# EAGLE design HUD-mohterboard (EAGLE 7.5.0)
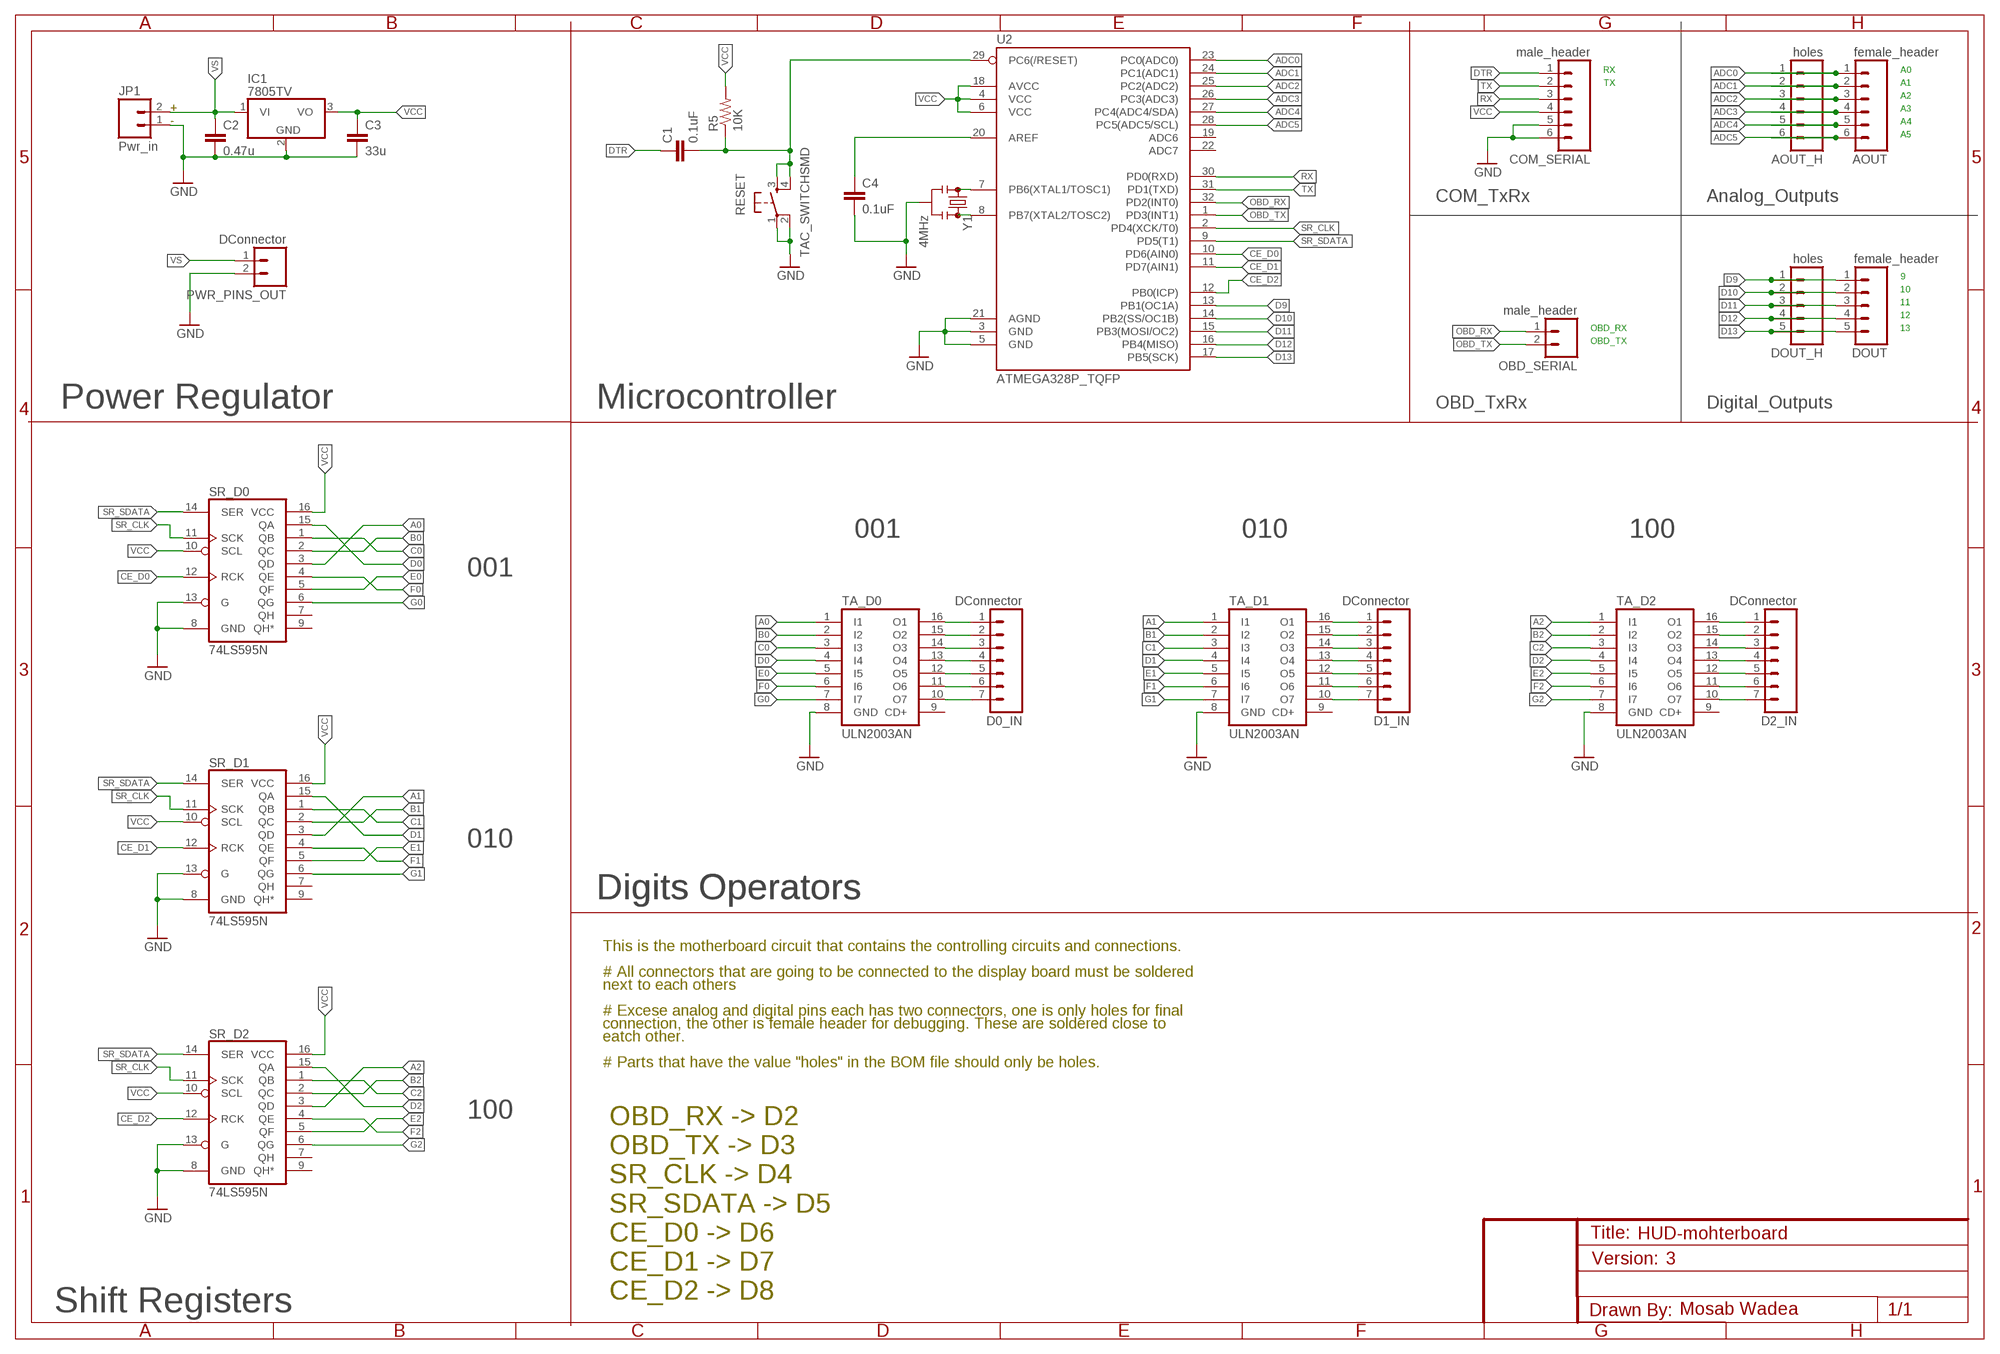
[diagram p0: schematic, sheet 1]

## Parts
AOUT  female_header  M06SILK_FEMALE_PTH  [1X06]
AOUT_H  holes  M06SILK_FEMALE_PTH  [1X06]
C1  0.1uF  CAP0805  [0805]
C2  0.47u  CAP0805  [0805]
C3  33u  CAP0805  [0805]
C4  0.1uF  CAP0805  [0805]
COM_SERIAL  male_header  M06SILK_FEMALE_PTH  [1X06]
D0_IN  DConnector  M07  [1X07]
D1_IN  DConnector  M07  [1X07]
D2_IN  DConnector  M07  [1X07]
DOUT  female_header  M05PTH  [1X05]
DOUT_H  holes  M05PTH  [1X05]
IC1  7805TV  [TO220V]
JP1  Pwr_in  M02PTH  [1X02]
OBD_SERIAL  male_header  M02PTH  [1X02]
PWR_PINS_OUT  DConnector  M02PTH  [1X02]
R5  10K  RESISTOR0805-RES  [0805]
RESET  TAC_SWITCHSMD  [TACTILE-SWITCH-SMD]
SR_D0  74LS595N  [DIL16]
SR_D1  74LS595N  [DIL16]
SR_D2  74LS595N  [DIL16]
TA_D0  ULN2003AN  [DIL16]
TA_D1  ULN2003AN  [DIL16]
TA_D2  ULN2003AN  [DIL16]
U2  ATMEGA328P_TQFP  [TQFP32-08]
Y1  4MHz  RESONATOR4MHZ  [RESONATOR-SMD_MED]

## Nets
A0: SR_D0.3(QD) TA_D0.1(I1)
A1: SR_D1.3(QD) TA_D1.1(I1)
A2: SR_D2.3(QD) TA_D2.1(I1)
ADC0: AOUT.1 AOUT_H.1 U2.23(PC0(ADC0))
ADC1: AOUT.2 AOUT_H.2 U2.24(PC1(ADC1))
ADC2: AOUT.3 AOUT_H.3 U2.25(PC2(ADC2))
ADC3: AOUT.4 AOUT_H.4 U2.26(PC3(ADC3))
ADC4: AOUT.5 AOUT_H.5 U2.27(PC4(ADC4/SDA))
ADC5: AOUT.6 AOUT_H.6 U2.28(PC5(ADC5/SCL))
B0: SR_D0.2(QC) TA_D0.2(I2)
B1: SR_D1.2(QC) TA_D1.2(I2)
B2: SR_D2.2(QC) TA_D2.2(I2)
C0: SR_D0.1(QB) TA_D0.3(I3)
C1: SR_D1.1(QB) TA_D1.3(I3)
C2: SR_D2.1(QB) TA_D2.3(I3)
CE_D0: SR_D0.12(RCK) U2.10(PD6(AIN0))
CE_D1: SR_D1.12(RCK) U2.11(PD7(AIN1))
CE_D2: SR_D2.12(RCK) U2.12(PB0(ICP))
D0: SR_D0.15(QA) TA_D0.4(I4)
D1: SR_D1.15(QA) TA_D1.4(I4)
D2: SR_D2.15(QA) TA_D2.4(I4)
D9: DOUT.1 DOUT_H.1 U2.13(PB1(OC1A))
D10: DOUT.2 DOUT_H.2 U2.14(PB2(SS/OC1B))
D11: DOUT.3 DOUT_H.3 U2.15(PB3(MOSI/OC2))
D12: DOUT.4 DOUT_H.4 U2.16(PB4(MISO))
D13: DOUT.5 DOUT_H.5 U2.17(PB5(SCK))
DTR: C1.1 COM_SERIAL.1
E0: SR_D0.5(QF) TA_D0.5(I5)
E1: SR_D1.5(QF) TA_D1.5(I5)
E2: SR_D2.5(QF) TA_D2.5(I5)
F0: SR_D0.4(QE) TA_D0.6(I6)
F1: SR_D1.4(QE) TA_D1.6(I6)
F2: SR_D2.4(QE) TA_D2.6(I6)
G0: SR_D0.6(QG) TA_D0.7(I7)
G1: SR_D1.6(QG) TA_D1.7(I7)
G2: SR_D2.6(QG) TA_D2.7(I7)
GND: C2.2 C3.2 C4.2 COM_SERIAL.5 COM_SERIAL.6 IC1.2(GND) JP1.1 PWR_PINS_OUT.2 RESET.1 RESET.2 SR_D0.8(GND) SR_D0.13(G) SR_D1.8(GND) SR_D1.13(G) SR_D2.8(GND) SR_D2.13(G) TA_D0.8(GND) TA_D1.8(GND) TA_D2.8(GND) U2.3(GND) U2.5(GND) U2.21(AGND) Y1.2
N$1: U2.7(PB6(XTAL1/TOSC1)) Y1.1
N$2: U2.8(PB7(XTAL2/TOSC2)) Y1.3
N$3: D0_IN.2 TA_D0.15(O2)
N$4: D0_IN.3 TA_D0.14(O3)
N$5: D0_IN.4 TA_D0.13(O4)
N$6: D0_IN.5 TA_D0.12(O5)
N$7: D0_IN.6 TA_D0.11(O6)
N$8: D1_IN.3 TA_D1.14(O3)
N$9: D1_IN.4 TA_D1.13(O4)
N$10: D1_IN.5 TA_D1.12(O5)
N$11: D2_IN.4 TA_D2.13(O4)
N$12: C4.1 U2.20(AREF)
N$29: D1_IN.2 TA_D1.15(O2)
N$30: D1_IN.1 TA_D1.16(O1)
N$32: D1_IN.6 TA_D1.11(O6)
N$33: D1_IN.7 TA_D1.10(O7)
N$43: D0_IN.1 TA_D0.16(O1)
N$46: D0_IN.7 TA_D0.10(O7)
N$55: D2_IN.3 TA_D2.14(O3)
N$56: D2_IN.2 TA_D2.15(O2)
N$57: D2_IN.1 TA_D2.16(O1)
N$58: D2_IN.5 TA_D2.12(O5)
N$59: D2_IN.6 TA_D2.11(O6)
N$60: D2_IN.7 TA_D2.10(O7)
OBD_RX: OBD_SERIAL.1 U2.32(PD2(INT0))
OBD_TX: OBD_SERIAL.2 U2.1(PD3(INT1))
RESET_WIRE: C1.2 R5.1 RESET.3 RESET.4 U2.29(PC6(/RESET))
RX: COM_SERIAL.3 U2.30(PD0(RXD))
SR_CLK: SR_D0.11(SCK) SR_D1.11(SCK) SR_D2.11(SCK) U2.2(PD4(XCK/T0))
SR_SDATA: SR_D0.14(SER) SR_D1.14(SER) SR_D2.14(SER) U2.9(PD5(T1))
TX: COM_SERIAL.2 U2.31(PD1(TXD))
VCC: C3.1 COM_SERIAL.4 IC1.3(VO) R5.2 SR_D0.10(SCL) SR_D0.16(VCC) SR_D1.10(SCL) SR_D1.16(VCC) SR_D2.10(SCL) SR_D2.16(VCC) U2.4(VCC) U2.6(VCC) U2.18(AVCC)
VS: C2.1 IC1.1(VI) JP1.2 PWR_PINS_OUT.1
Unconnected: SR_D0.7(QH) SR_D0.9(QH*) SR_D1.7(QH) SR_D1.9(QH*) SR_D2.7(QH) SR_D2.9(QH*) TA_D0.9(CD+) TA_D1.9(CD+) TA_D2.9(CD+) U2.19(ADC6) U2.22(ADC7)

## Notes on the sheet
- RX | A0
- TX | A1
- A2
- + | A3
- - | A4
- A5
- COM_TxRx | Analog_Outputs
- 9
- 10
- 11
- 12
- OBD_RX | 13
- OBD_TX
- Power Regulator | Microcontroller | OBD_TxRx | Digital_Outputs
- 001 | 010 | 100
- 001
- 010
- Digits Operators | Digits Operators
- This is the motherboard circuit that contains the controlling circuits and connections.
- # All connectors that are going to be connected to the display board must be soldered
- next to each others
- # Excese analog and digital pins each has two connectors, one is only holes for final
- connection, the other is female header for debugging. These are soldered close to
- eatch other.
- # Parts that have the value "holes" in the BOM file should only be holes.
- 100
- 3
- OBD_RX -> D2
  OBD_TX -> D3
  SR_CLK -> D4
  SR_SDATA -> D5
  CE_D0 -> D6
  CE_D1 -> D7
  CE_D2 -> D8
- Shift Registers | Mosab Wadea

## Library data of the parts
AOUT AOUT_H COM_SERIAL = SparkFun-Connectors:M06: Header 6 Standard 6-pin 0.1" header. Use with straight break away headers (SKU : PRT-00116), right angle break away headers (PRT-00553), swiss pins (PRT-00743), machine pins (PRT-00117), and female headers (PRT-00115). Molex polarized connector foot print use with SKU : PRT-08094 with associated crimp pins and housings. NOTES ON THE VARIANTS LOCK and LOCK_LONGPADS... This footprint was designed to help hold the alignment of a through-hole component (i.e. 6-pin header) while soldering it into place. You may notice that each hole has been shifted either up or down by 0.005 of an inch from it's more standard position (which is a perfectly straight line). This slight alteration caused the pins (the squares in the middle) to touch the edges of the holes. Because they are alternating, it causes a "brace" to hold the component in place. 0.005 has proven to be the perfect amount of "off-center" position when using our standard breakaway headers. Although looks a little odd when you look at the bare footprint, once you have a header in there, the alteration is very hard to notice. Also,if you push a header all the way into place, it is covered up entirely on the bottom side. This idea of altering the position of holes to aid alignment will be further integrated into the Sparkfun Library for other footprints. It can help hold any component with 3 or more connection pins.; PROD_ID: CONN-08437
C1-C4 = SparkFun-Passives:CAP: Capacitor Standard 0603 ceramic capacitor, and 0.1" leaded capacitor.
D0_IN D1_IN D2_IN = SparkFun-Connectors:M07: Header 7 Standard 7-pin 0.1" header. Use with straight break away headers (SKU : PRT-00116), right angle break away headers (PRT-00553), swiss pins (PRT-00743), machine pins (PRT-00117), and female headers (PRT-00115). NOTES ON THE VARIANTS LOCK and LOCK_LONGPADS... This footprint was designed to help hold the alignment of a through-hole component (i.e. 7-pin header) while soldering it into place. You may notice that each hole has been shifted either up or down by 0.005 of an inch from it's more standard position (which is usually a perfectly straight line). This slight alteration caused the pins (the squares in the middle) to touch the edges of the holes. Because they are alternating, it causes a "brace" to hold the header in place. 0.005 has proven to be the perfect amount of "off-center" position when using our standard breakaway headers. Although looks a little odd when you look at the bare footprint, once you have a header in there, the alteration is very hard to notice. Also, if you push a header all the way into place, it is covered up entirely on the bottom side. This idea of altering the position of holes to aid alignment will be further integrated into the Sparkfun Library for other footprints. It can help hold any component with 3 or more connection pins.
DOUT DOUT_H = SparkFun-Connectors:M05: Header 5 Standard 5-pin 0.1" header. Use with straight break away headers (SKU : PRT-00116), right angle break away headers (PRT-00553), swiss pins (PRT-00743), machine pins (PRT-00117), and female headers (PRT-00115). Molex polarized connector foot print use with SKU : PRT-08230 with associated crimp pins and housings.
IC1 = linear:78*: Positive VOLTAGE REGULATOR Source: http://cache.national.com/ds/LM/LM78L05.pdf http://www.fairchildsemi.com/ds/LM/LM7805.pdf
JP1 OBD_SERIAL PWR_PINS_OUT = SparkFun-Connectors:M02: Standard 2-pin 0.1" header. Use with - straight break away headers ( PRT-00116) - right angle break away headers (PRT-00553) - swiss pins (PRT-00743) - machine pins (PRT-00117) - female headers (PRT-00115) Molex polarized connector foot print use with: PRT-08233 with associated crimp pins and housings. 2.54_SCREWTERM for use with PRT-10571. 3.5mm Screw Terminal footprints for PRT-08084 5mm Screw Terminal footprints for use with PRT-08432
R5 = SparkFun-Resistors:RESISTOR: Resistor Basic schematic elements and footprints for 0603, 1206, and PTH resistors.
RESET = SparkFun-Retired:TAC_SWITCH: Momentary Switch Button commonly used for reset or general input. Spark Fun Electronics SKU : COM-00097 SMT- SWCH-08247; PROD_ID: SWCH-08247
SR_D0 SR_D1 SR_D2 = SparkFun-DigitalIC:74*595: 8-bit SHIFT REGISTER, output latch
TA_D0 TA_D1 TA_D2 = uln-udn:ULN2003A: DRIVER ARRAY
U2 = SparkFun-DigitalIC:ATMEGA328P_TQFP; PROD_ID: IC-09069
Y1 = SparkFun-FreqCtrl:RESONATOR: Resonator Small SMD resonator. Used, eg, on the Arduino Pro/ Pro Mini boards. 8MHz- XTAL-08895 16MHz- XTAL-08900; PROD_ID: XTAL-12492

## Net classes
2 gnd: width 0.305 mm, drill 0.559 mm, clearance 0.254 mm
3 usbvcc: width 0.508 mm, drill 0.61 mm, clearance 0.254 mm

## Board
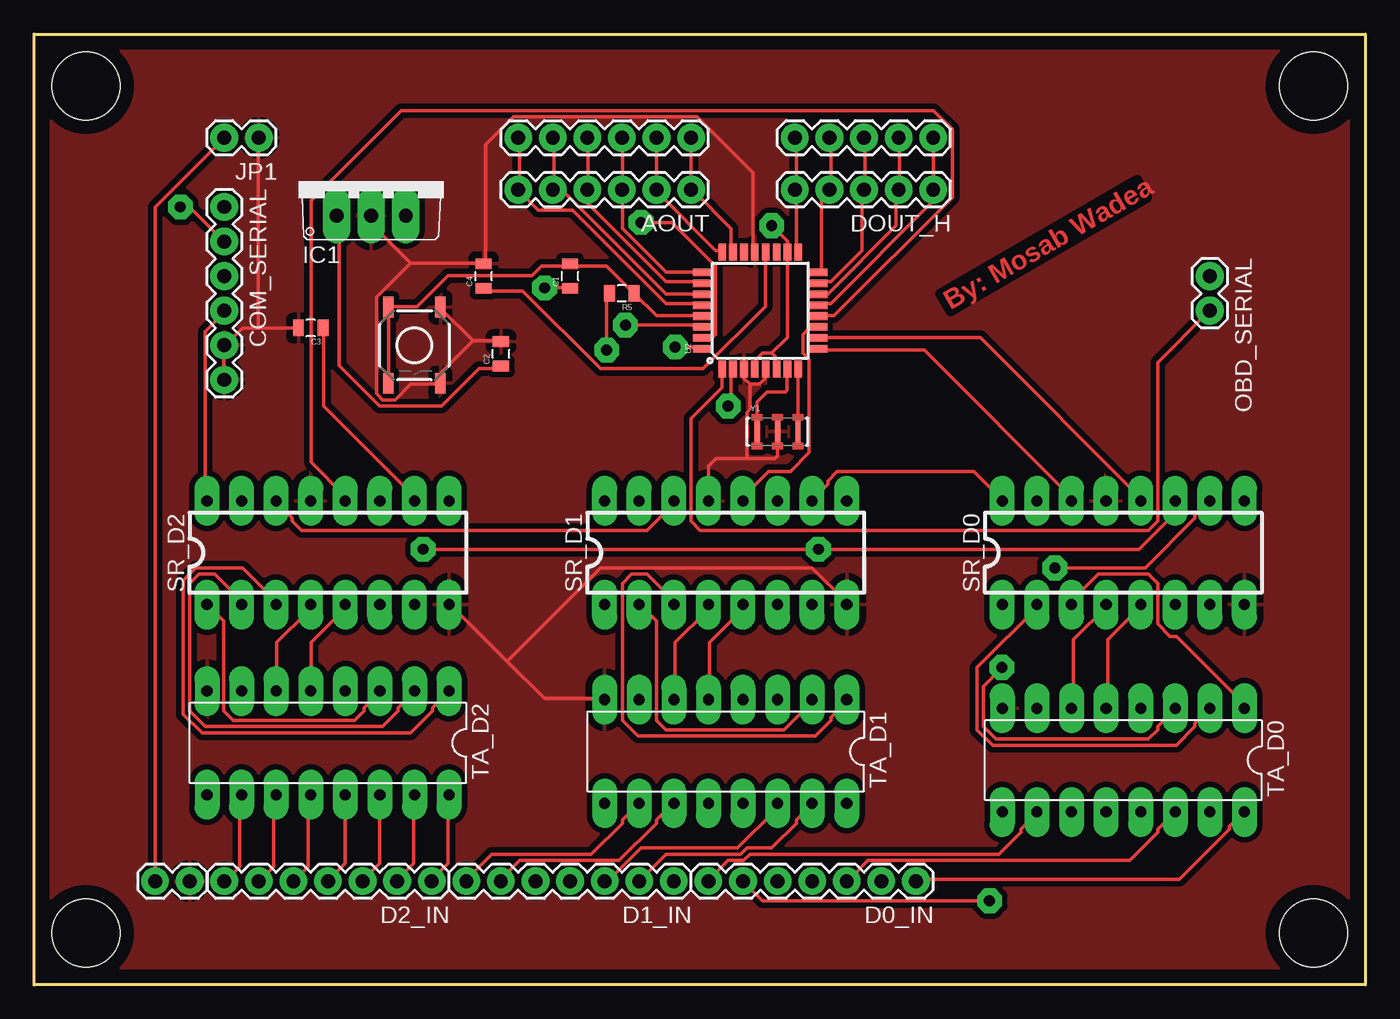
[diagram p1: board, top side]
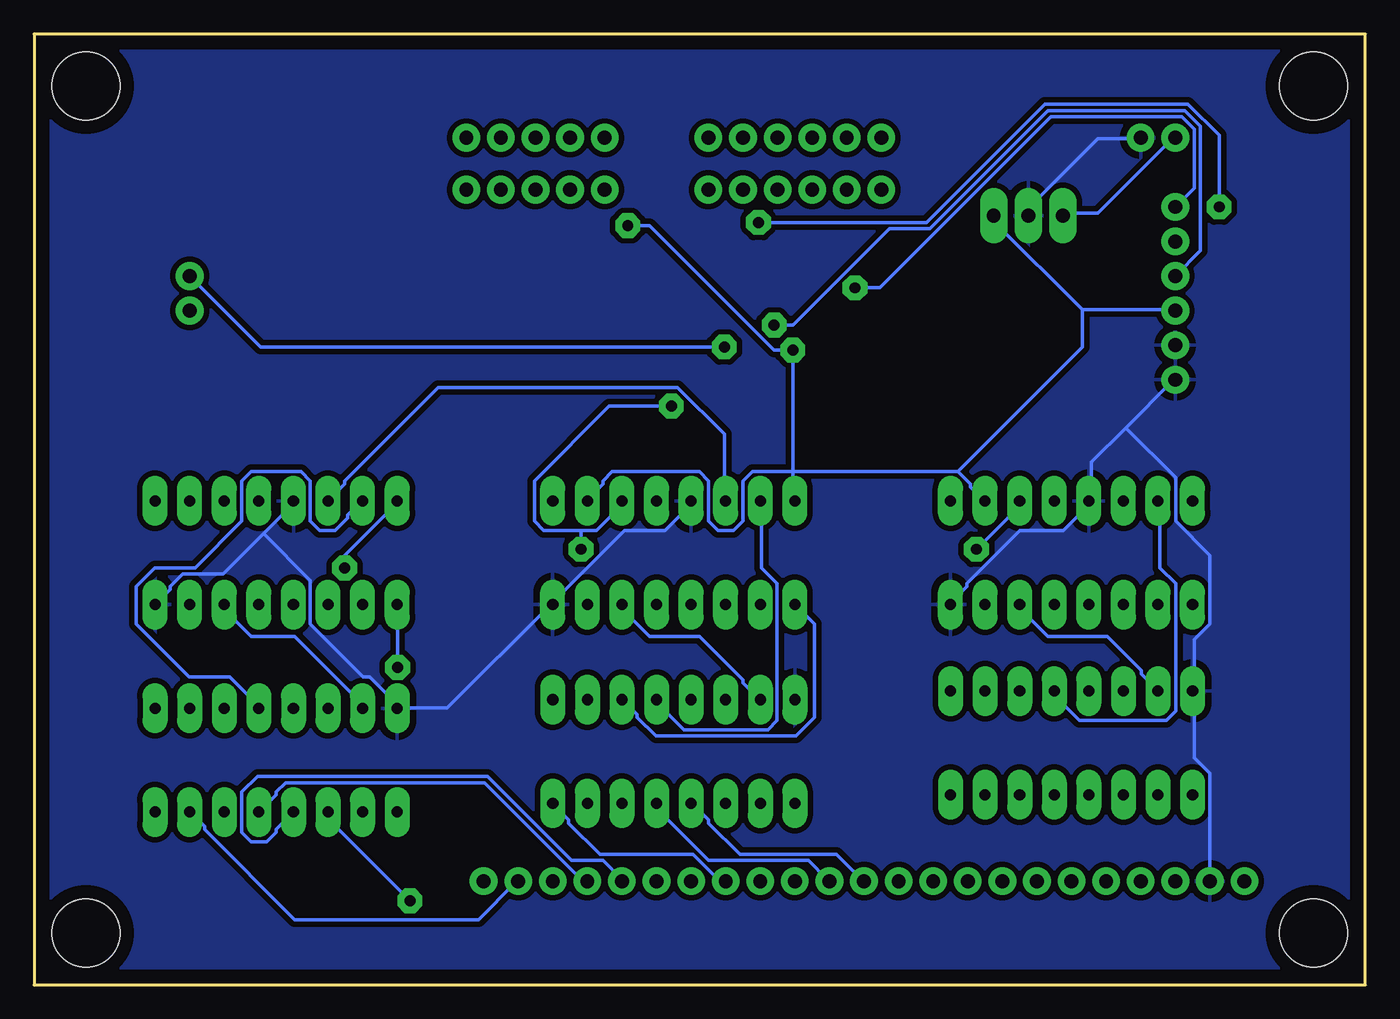
[diagram p2: board, bottom side, seen from below]

Size 97.79 x 69.85 mm. Coordinates in mm from the lower left corner, seen from the top.
Outline: 0,0 0,69.85 97.79,69.85 97.79,0 0,0
Copper layers (1*16): Top 0.035mm / dielectric 1.5mm / Bottom 0.035mm
Design rules "default *": minimum track width 10mil, minimum drill 0.8mm, track to track 8mil, track to pad 8mil, pad to pad 8mil, via to via 8mil, smd to smd 8mil, copper to edge 40mil, drill to drill 8mil, minimum pad ring 10mil, minimum via ring 8mil, stop-mask expansion 4mil, vias tented up to drill 0mil, thermal gap 20mil
Holes 5 mm at 3.81,66.04 93.98,66.04 93.98,3.81 3.81,3.81
vRestrict: area 49.5,45.7 to 57.2,53.3

### Footprints (pad centres in the part's own frame; a part is rotated, then mirrored left to right if it is on the bottom)
1X06 = drill 1.016 pad 1.88: 1 0,0; 2 2.54,0; 3 5.08,0; 4 7.62,0; 5 10.16,0; 6 12.7,0
0805 = smd 0.8 x 1.2: 1 -0.9,0; 2 0.9,0
1X07 = drill 1.016 pad 1.88: 1 0,0; 2 2.54,0; 3 5.08,0; 4 7.62,0; 5 10.16,0; 6 12.7,0; 7 15.24,0
1X05 = drill 1.016 pad 1.88: 1 0,0; 2 2.54,0; 3 5.08,0; 4 7.62,0; 5 10.16,0
TO220V = drill 1.016 long: 1 -2.54,-2.54; 2 0,-2.54; 3 2.54,-2.54
1X02 = drill 1.016 pad 1.88: 1 0,0; 2 2.54,0
TACTILE-SWITCH-SMD = smd 1.524 x 0.762: 1 -2.794,1.905; 2 2.794,1.905; 3 -2.794,-1.905; 4 2.794,-1.905
DIL16 = drill 0.813 long: 1 -8.89,-3.81; 2 -6.35,-3.81; 3 -3.81,-3.81; 4 -1.27,-3.81; 5 1.27,-3.81; 6 3.81,-3.81; 7 6.35,-3.81; 8 8.89,-3.81; 9 8.89,3.81; 10 6.35,3.81; 11 3.81,3.81; 12 1.27,3.81; 13 -1.27,3.81; 14 -3.81,3.81; 15 -6.35,3.81; 16 -8.89,3.81
TQFP32-08 = smd 1.27 x 0.559: 1 -4.293,2.8; 2 -4.293,2; 3 -4.293,1.2; 4 -4.293,0.4; 5 -4.293,-0.4; 6 -4.293,-1.2; 7 -4.293,-2; 8 -4.293,-2.8; 17 4.293,-2.8; 18 4.293,-2; 19 4.293,-1.2; 20 4.293,-0.4; 21 4.293,0.4; 22 4.293,1.2; 23 4.293,2; 24 4.293,2.8 | smd 0.559 x 1.27: 9 -2.8,-4.293; 10 -2,-4.293; 11 -1.2,-4.293; 12 -0.4,-4.293; 13 0.4,-4.293; 14 1.2,-4.293; 15 2,-4.293; 16 2.8,-4.293; 25 2.8,4.293; 26 2,4.293; 27 1.2,4.293; 28 0.4,4.293; 29 -0.4,4.293; 30 -1.2,4.293; 31 -2,4.293; 32 -2.8,4.293
RESONATOR-SMD_MED = smd 0.4 x 1.6: 1 -1.5,0; 2 0,0; 3 1.5,0

### Placement (x,y rotation side)
AOUT  48.26,58.42 180 top
AOUT_H  48.26,62.23 180 top
C1  39.37,52.07 90 top
C2  34.29,46.35 90 top
C3  20.32,48.26 180 top
C4  33.02,52.07 90 top
COM_SERIAL  13.97,57.15 270 top
D0_IN  64.77,7.62 180 top
D1_IN  46.99,7.62 180 top
D2_IN  29.21,7.62 180 top
DOUT  66.04,62.23 180 top
DOUT_H  66.04,58.42 180 top
IC1  24.77,59.05 0 top
JP1  16.51,62.23 180 top
OBD_SERIAL  86.36,52.07 270 top
PWR_PINS_OUT  8.89,7.62 0 top
R5  43.18,50.8 180 top
RESET  27.94,46.99 270 top
SR_D0  80.01,31.75 0 top
SR_D1  50.8,31.75 0 top
SR_D2  21.59,31.75 0 top
TA_D0  80.01,16.51 180 top
TA_D1  50.8,17.14 180 top
TA_D2  21.59,17.78 180 top
U2  53.34,49.53 90 top
Y1  54.61,40.64 0 top

### Tracks (layer width: path | path; a pad name or v marks a point on that pad's centre or on a via)
A0
  Top 0.254: TA_D0.1 88.7,20.34 88.7,20.8 83.9,25.6 83.44,25.6 82.53,26.52 82.53,29.49 81.84,30.18 78.18,30.18 76.12,28.12 SR_D0.3
A1
  Top 0.254: TA_D1.1 59.66,20.8 58.52,19.66 58.52,19.43 57.38,18.29 44.35,18.29 43.2,19.43 43.2,29.49 43.89,30.18 45.03,30.18 47.09,28.12 SR_D1.3
A2
  Top 0.254: TA_D2.1 30.4,21.49 29.26,20.34 29.26,20.12 27.66,18.52 12.34,18.52 10.97,19.89 10.97,29.72 11.89,30.63 15.32,30.63 17.83,28.12 SR_D2.3
ADC0
  Top 0.254: U2.23 51.21,53.95 51.21,55.55 48.46,58.29 AOUT.1 48.23,58.52 48.23,62.18 AOUT_H.1
ADC1
  Top 0.254: U2.24 50.52,53.95 50.06,53.95 45.72,58.29 AOUT.2 AOUT_H.2
ADC2
  Top 0.254: U2.25 48.92,52.35 46.41,52.35 43.2,55.55 43.2,58.29 AOUT.3 43.2,58.52 43.2,62.18 AOUT_H.3
ADC3
  Top 0.254: U2.26 48.92,51.66 46.41,51.66 40.69,57.38 40.69,58.29 AOUT.4 40.69,58.52 40.69,62.18 AOUT_H.4
ADC4
  Top 0.254: U2.27 48.92,50.75 46.41,50.75 38.86,58.29 38.18,58.29 AOUT.5 38.18,58.52 38.18,62.18 AOUT_H.5
ADC5
  Top 0.254: U2.28 48.92,50.06 46.41,50.06 39.55,56.92 37.03,56.92 35.66,58.29 AOUT.6 35.66,58.52 35.66,62.18 AOUT_H.6
B0
  Top 0.254: TA_D0.2 86.18,20.12 85.27,19.2 85.27,18.97 83.9,17.6 70.41,17.6 69.27,18.75 69.27,23.32 73.84,27.89 SR_D0.2
B1
  Top 0.254: TA_D1.2 57.15,20.8 55.09,18.75 46.41,18.75 45.72,19.43 45.72,26.75 44.58,27.89 SR_D1.2
B2
  Top 0.254: TA_D2.2 27.89,21.49 26.75,20.34 26.75,20.12 25.6,18.97 12.57,18.97 11.43,20.12 11.43,29.49 12.12,30.18 13.26,30.18 15.32,28.12 SR_D2.2
C0  (via drill 0.8)
  Top 0.254: v71.09,23.32 69.72,21.95 69.72,18.97 70.64,18.06 81.84,18.06 82.53,18.75 82.53,18.97 83.67,20.12 TA_D0.3
  Bottom 0.254: v71.09,23.32 71.09,27.89 SR_D0.1
C1
  Bottom 0.254: TA_D1.3 54.41,20.8 53.49,19.89 53.49,19.66 52.12,18.29 41.83,18.29 40.46,19.66 40.46,26.52 41.83,27.89 SR_D1.1
C2
  Top 0.254: TA_D2.3 25.38,21.49 24.23,20.34 24.23,20.12 23.55,19.43 14.63,19.43 13.95,20.12 13.95,26.75 12.8,27.89 SR_D2.1
CE_D0
  Top 0.254: U2.10 57.84,47.55 69.49,47.55 81.38,35.66 SR_D0.12
CE_D1
  Top 0.254: U2.11 57.61,48.23 56.92,48.23 56.46,47.78 56.46,46.41 56.92,45.95 56.92,39.09 55.55,37.72 53.95,37.72 51.89,35.66 SR_D1.12
CE_D2
  Top 0.254: SR_D2.12 22.86,35.89 20.34,38.41 20.34,57.61 26.98,64.24 66.06,64.24 67.44,62.87 67.44,57.84 58.75,49.15 57.84,49.15 U2.12
D0
  Bottom 0.254: SR_D0.15 73.84,35.43 74.75,34.52 74.75,34.29 75.67,33.38 76.81,33.38 77.5,34.06 77.5,37.03 78.18,37.72 81.84,37.72 82.53,37.03 82.53,34.06 85.95,30.63 88.92,30.63 90.3,29.26 90.3,26.52 86.41,22.63 83.44,22.63 81.15,20.34 TA_D0.4
D1
  Bottom 0.254: SR_D1.15 44.35,35.43 44.35,30.63 43.2,29.49 43.2,19.43 43.89,18.75 50.06,18.75 52.12,20.8 TA_D1.4
D2
  Bottom 0.254: TA_D2.4 22.86,21.26 21.03,19.43 14.63,19.43 13.95,20.12 13.95,29.49 15.09,30.63 15.09,35.43 SR_D2.15
D9
  Top 0.254: U2.13 57.84,50.06 58.52,50.06 65.84,57.38 65.84,58.29 DOUT_H.1 66.06,58.52 66.06,62.18 DOUT.1
D10
  Top 0.254: U2.14 57.84,50.75 58.29,50.75 63.32,55.78 63.32,58.29 DOUT_H.2 63.55,58.52 63.55,62.18 DOUT.2
D11
  Top 0.254: U2.15 57.84,51.66 58.52,51.66 60.81,53.95 60.81,58.29 DOUT_H.3 61.04,58.52 61.04,62.18 DOUT.3
D12
  Top 0.254: U2.16 57.84,52.35 57.84,57.84 DOUT_H.4 58.52,58.52 58.52,62.18 DOUT.4
D13
  Top 0.254: U2.17 56.01,53.95 56.01,58.29 DOUT_H.5 56.01,58.52 56.01,62.18 DOUT.5
DTR  (via drill 0.8)
  Top 0.254: v37.49,51.21 39.32,51.21 C1.1
  Bottom 0.254: v37.49,51.21 35.66,51.21 23.09,63.78 13.49,63.78 12.57,62.87 12.57,58.52 13.95,57.15 COM_SERIAL.1
E0
  Top 0.254: TA_D0.5 78.87,20.34 78.87,25.38 81.38,27.89 SR_D0.5
E1
  Top 0.254: TA_D1.5 49.61,21.03 49.61,25.15 51.89,27.43 51.89,27.89 SR_D1.5
E2
  Top 0.254: SR_D2.5 22.86,27.66 20.34,25.15 20.34,21.72 TA_D2.5
F0
  Top 0.254: TA_D0.6 76.35,20.34 76.35,25.38 78.87,27.89 SR_D0.4
F1
  Top 0.254: TA_D1.6 47.09,21.03 47.09,25.15 49.38,27.43 49.38,27.89 SR_D1.4
F2
  Top 0.254: TA_D2.6 17.83,21.72 17.83,25.15 20.12,27.43 20.12,27.89 SR_D2.4
G0
  Bottom 0.254: TA_D0.7 73.84,20.34 73.84,20.8 78.64,25.6 81.84,25.6 83.67,27.43 83.67,27.89 SR_D0.6
G1
  Bottom 0.254: TA_D1.7 44.58,21.03 45.72,22.17 45.72,22.4 48.92,25.6 52.58,25.6 54.41,27.43 54.41,27.89 SR_D1.6
G2
  Bottom 0.254: TA_D2.7 15.32,21.72 16.46,22.86 16.46,23.09 18.97,25.6 23.32,25.6 25.6,27.89 SR_D2.6
GND
  Top 0.254: Y1.2 54.61,38.86 54.42,38.67 52.35,38.67 | 52.35,38.67 50.1,38.67 49.53,38.1 SR_D1.13 | 52.58,44.12 52.12,44.58 52.12,45.03 U2.3 | 52.58,44.12 53.26,44.12 53.72,44.58 53.72,45.03 U2.5 | 52.58,44.12 52.58,42.29 52.35,42.06 52.35,38.67 | 52.35,38.63 52.35,38.67 | 32.23,47.32 34.29,47.32 C2.2 | 32.23,47.32 29.95,49.61 RESET.1 | 32.23,47.32 29.95,45.03 29.95,44.35 RESET.2 29.72,44.12 27.66,44.12 26.52,42.98 25.6,42.98 25.15,43.43 25.15,50.52 27.66,53.03 | 27.66,53.03 32.92,53.03 C4.2 33.15,53.03 33.15,61.72 35.2,63.78 48.69,63.78 52.81,59.66 52.81,53.95 U2.21 | 27.66,53.03 24.92,55.78 24.92,56.46 IC1.2 | 34.75,23.77 30.63,27.89 SR_D2.8 | 34.75,23.77 37.49,21.03 41.83,21.03 TA_D1.8 | 16.46,48.23 15.32,48.23 14.17,47.09 COM_SERIAL.5 13.95,46.86 13.95,44.58 COM_SERIAL.6 | 16.46,48.23 19.2,48.23 C3.2 | 16.46,48.23 16.46,62.18 JP1.1 | 34.75,23.77 41.6,30.63 57.15,30.63 59.66,28.12 SR_D1.8
  Bottom 0.254: 80.92,33.15 78.64,35.43 SR_D0.13 | 80.92,33.15 83.9,30.18 86.87,30.18 87.78,29.26 87.78,29.03 88.7,28.12 SR_D0.8 | SR_D1.13 49.38,35.43 51.44,33.38 54.41,33.38 59.66,28.12 SR_D1.8 59.89,27.89 67.44,20.34 70.87,20.34 | 70.87,20.34 71.09,20.34 TA_D0.8 70.87,20.34 | 80.92,33.15 77.5,29.72 77.5,26.52 73.61,22.63 73.15,22.63 70.87,20.34 | JP1.1 16.69,62.18 19.66,62.18 24.69,57.15 24.69,56.69 IC1.2 | PWR_PINS_OUT.2 11.43,15.54 12.57,16.69 12.57,21.49 TA_D2.8 12.57,21.72 12.57,25.38 11.43,26.52 11.43,31.55 13.95,34.06 13.95,37.26 17.6,40.92 | 17.6,40.92 14.17,44.35 COM_SERIAL.6 | 17.6,40.92 20.12,38.41 20.12,35.66 SR_D2.13 20.12,35.43 22.17,33.38 25.38,33.38 29.26,29.49 29.26,29.26 30.4,28.12 SR_D2.8
  pour Top (isolate 0.4): 0,0 0,69.85 97.79,69.85 97.79,0
  pour Bottom (isolate 0.4): 0,0 0,69.85 97.79,69.85 97.79,0
N$1
  Top 0.254: Y1.1 53.11,42.82 53.85,43.56 55.18,43.56 55.31,43.69 55.31,45.21 U2.7
N$2
  Top 0.254: Y1.3 56.11,45.21 U2.8
N$3
  Bottom 0.254: TA_D0.15 86.18,12.57 85.27,11.66 85.27,11.43 78.64,4.8 65.15,4.8 62.41,7.54 D0_IN.2
N$4
  Top 0.254: TA_D0.14 83.67,12.57 82.53,11.43 82.53,11.2 80.47,9.14 61.27,9.14 59.89,7.77 D0_IN.3
N$5
  Bottom 0.254: TA_D0.13 81.15,12.8 80.01,13.95 80.01,14.17 79.32,14.86 64.69,14.86 57.61,7.77 57.15,7.77 D0_IN.4
N$6
  Bottom 0.254: TA_D0.12 80.01,11.43 80.01,11.2 80.7,10.52 81.84,10.52 82.53,11.2 82.53,14.17 81.38,15.32 64.47,15.32 58.29,9.14 56.01,9.14 54.63,7.77 D0_IN.5
N$7  (via drill 0.8)
  Top 0.254: v70.18,6.17 53.49,6.17 52.12,7.54 D0_IN.6
  Bottom 0.254: v70.18,6.17 76.12,12.12 76.12,12.57 TA_D0.11
N$8
  Top 0.254: TA_D1.14 54.41,13.26 54.41,12.8 51.66,10.06 44.58,10.06 42.06,7.54 D1_IN.3
N$9
  Bottom 0.254: TA_D1.13 51.89,13.26 51.89,12.8 48.23,9.14 40.92,9.14 39.55,7.77 D1_IN.4
N$10
  Bottom 0.254: TA_D1.12 49.38,13.26 48.23,12.12 48.23,11.89 45.95,9.6 38.86,9.6 37.03,7.77 D1_IN.5
N$11
  Top 0.254: TA_D2.13 22.86,8.91 21.72,7.77 D2_IN.4
N$12
  Top 0.254: C4.1 33.15,50.98 35.89,50.98 41.6,45.26 49.15,45.26 53.72,49.84 53.72,53.72 U2.20
N$29
  Top 0.254: TA_D1.15 57.15,13.26 56.01,12.12 56.01,11.89 54.18,10.06 52.35,10.06 51.89,9.6 46.41,9.6 44.58,7.77 D1_IN.2
N$30
  Bottom 0.254: TA_D1.16 59.66,13.26 58.52,12.12 58.52,11.89 56.24,9.6 49.38,9.6 47.55,7.77 47.09,7.77 D1_IN.1
N$32
  Top 0.254: TA_D1.11 46.86,13.26 45.72,12.12 45.72,11.89 42.98,9.14 35.66,9.14 34.29,7.77 D1_IN.6
N$33
  Top 0.254: TA_D1.10 44.35,13.26 43.2,12.12 43.2,11.89 40.92,9.6 33.6,9.6 31.77,7.77 D1_IN.7
N$43
  Top 0.254: TA_D0.16 88.7,12.57 87.78,11.66 87.78,11.43 84.12,7.77 64.92,7.77 D0_IN.1
N$46
  Top 0.254: TA_D0.10 73.61,12.57 72.47,11.43 72.47,11.2 70.87,9.6 52.58,9.6 52.12,9.14 50.98,9.14 49.61,7.77 D0_IN.7
N$55
  Top 0.254: TA_D2.14 25.38,13.95 25.38,8.91 24.23,7.77 D2_IN.3
N$56
  Top 0.254: TA_D2.15 27.89,13.95 27.89,8.91 26.75,7.77 D2_IN.2
N$57
  Top 0.254: TA_D2.16 30.4,13.95 30.4,8.91 29.26,7.77 D2_IN.1
N$58
  Top 0.254: D2_IN.5 20.12,8.69 20.12,13.95 TA_D2.12
N$59
  Top 0.254: TA_D2.11 17.6,13.95 17.6,8.69 16.69,7.77 D2_IN.6
N$60
  Top 0.254: TA_D2.10 15.09,13.95 15.09,8.69 14.17,7.77 D2_IN.7
OBD_RX  (via drill 0.8)
  Top 0.254: v47.09,46.86 48.92,46.86 U2.32
  Bottom 0.254: v47.09,46.86 81.15,46.86 OBD_SERIAL.1
OBD_TX
  Top 0.254: U2.1 50.52,45.03 50.52,43.89 48.23,41.6 48.23,34.06 48.92,33.38 81.84,33.38 82.53,34.06 82.53,45.72 86.18,49.38 OBD_SERIAL.2
RESET_WIRE
  Top 0.254: RESET.4 26.06,44.35 26.06,49.61 RESET.3 26.06,49.84 28.12,49.84 30.4,52.12 36.58,52.12 37.26,52.81 39.32,52.81 C1.2 39.55,52.81 42.06,52.81 43.89,50.98 R5.1 44.12,50.75 45.72,49.15 48.92,49.15 U2.29
RX  (via drill 0.8)
  Top 0.254: v43.43,48.46 48.92,48.46 U2.30
  Bottom 0.254: v43.43,48.46 42.06,48.46 34.98,55.55 32,55.55 23.32,64.24 13.26,64.24 12.12,63.09 12.12,53.95 13.95,52.12 COM_SERIAL.3
SR_CLK  (via drill 0.8)
  Top 0.254: v50.98,42.52 51.21,42.75 51.21,45.03 U2.2 | v28.57,32 v57.61,32 81.15,32 83.67,34.52 83.67,35.43 SR_D0.11
  Bottom 0.254: v50.98,42.52 55.55,42.52 61.04,37.03 61.04,34.06 60.35,33.38 57.61,33.38 | 57.61,33.38 56.46,33.38 54.41,35.43 SR_D1.11 | v28.57,32 25.6,34.98 25.6,35.43 SR_D2.11 | 57.61,33.38 v57.61,32
SR_SDATA
  Top 0.254: U2.9 57.84,46.63 65.38,46.63 76.35,35.66 SR_D0.14 | SR_D2.14 17.83,35.43 18.97,34.29 18.97,34.06 19.66,33.38 45.03,33.38 47.09,35.43 SR_D1.14
  Bottom 0.254: SR_D0.14 76.12,35.66 74.98,36.8 74.98,37.03 68.12,43.89 50.52,43.89 47.09,40.46 47.09,35.66 SR_D1.14
TX  (via drill 0.8)
  Top 0.254: v44.58,56.01 46.86,56.01 50.06,52.81 50.06,47.78 49.84,47.55 49.15,47.55 U2.31 | v10.74,57.15 11.43,57.15 COM_SERIAL.2
  Bottom 0.254: v44.58,56.01 32.23,56.01 23.55,64.69 13.03,64.69 10.74,62.41 v10.74,57.15
VCC  (via drill 0.8)
  Top 0.254: SR_D2.16 12.57,35.66 12.57,48.01 13.95,49.38 COM_SERIAL.4 | SR_D1.10 57.15,35.66 58.29,36.8 58.29,37.03 58.98,37.72 69.04,37.72 71.09,35.66 SR_D0.16 | v74.98,30.63 81.61,30.63 85.27,34.29 85.27,34.52 86.18,35.43 SR_D0.10 | C3.1 21.26,48.23 21.26,42.52 28.12,35.66 SR_D2.10 | 54.18,46.41 53.49,46.41 53.03,45.95 53.03,45.26 U2.4 | 54.18,46.41 54.41,46.18 54.41,45.26 U2.6 | 54.18,46.41 55.32,47.55 55.32,53.72 U2.18 55.32,53.95 55.32,54.63 v54.18,55.78 | v42.06,46.63 42.06,50.75 R5.2
  Bottom 0.254: 20.8,49.61 27.2,56.01 27.2,56.46 IC1.3 | 20.8,49.61 14.17,49.61 COM_SERIAL.4 | v74.98,30.63 74.98,31.55 71.09,35.43 SR_D0.16 | 42.06,37.72 42.06,35.66 SR_D1.16 | 42.06,37.72 v42.06,46.63 43.43,46.63 52.58,55.78 v54.18,55.78 | 29.95,37.72 29.03,36.8 29.03,36.58 28.12,35.66 SR_D2.10 | 42.06,37.72 29.95,37.72 | 42.06,37.72 45.03,37.72 45.72,37.03 45.72,34.06 46.41,33.38 47.55,33.38 48.23,34.06 48.23,37.03 48.92,37.72 55.32,37.72 56.01,37.03 56.01,36.8 57.15,35.66 SR_D1.10 | 20.8,49.61 20.8,46.86 29.95,37.72
VS
  Top 0.254: C2.1 34.29,45.26 32.69,45.26 29.95,42.52 25.38,42.52 22.4,45.49 22.4,56.46 IC1.1 | PWR_PINS_OUT.1 8.91,7.77 8.91,57.15 13.95,62.18 JP1.2
  Bottom 0.254: IC1.1 22.17,56.69 19.66,56.69 14.17,62.18 JP1.2

### Text on the board
Top: By: Mosab Wadea